# Altium schematic sheet PM12_ADT7311.SchDoc
size A4; SheetNumber: 14; SheetTotal: 33
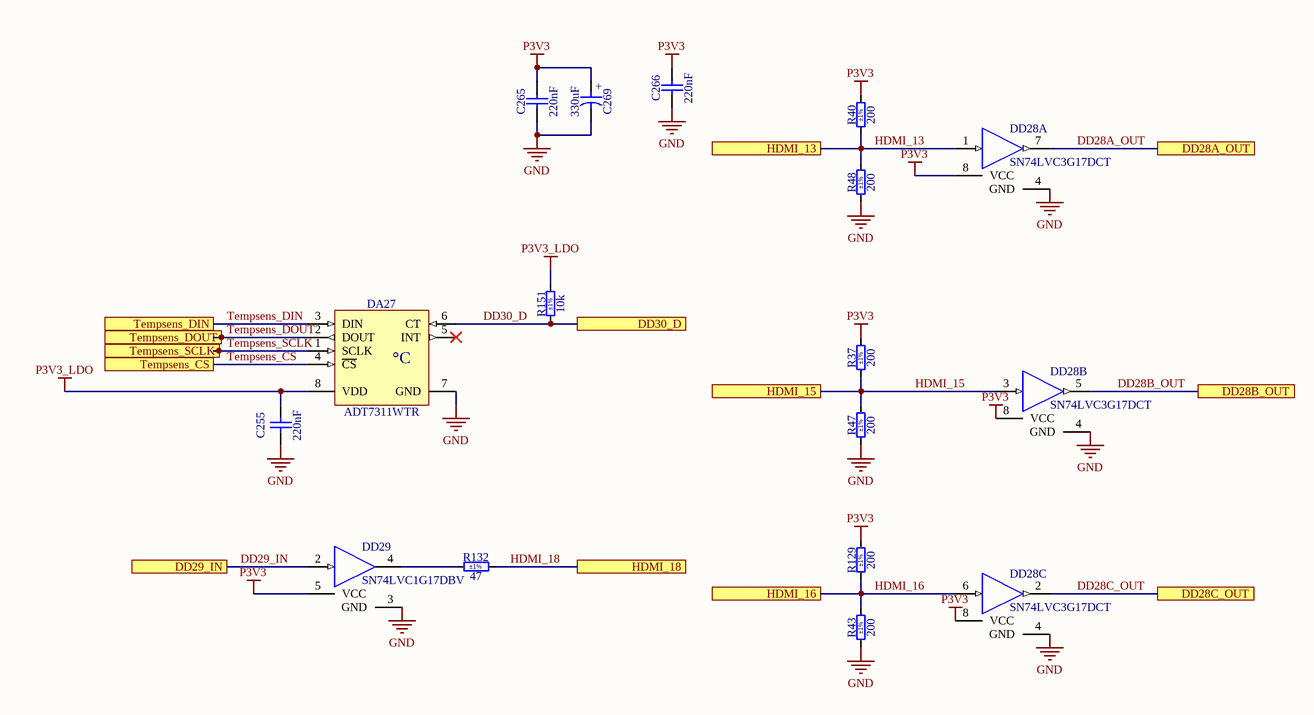
[diagram p0: PM12_ADT7311.SchDoc]

## Parts
C255  220nF  [CAPC2012X135N]
C265  220nF  [CAPC2012X135N]
C266  220nF  [CAPC2012X135N]
C269  330uF  [CAPMP7343X310N]
DA27  ADT7311WTR  [SOIC127P600X175-8N]
DD28  SN74LVC3G17DCT  [SOP65P400X130-8N]  (parts A,B,C of 3)
DD29  SN74LVC1G17DBV  [SOT95P280X145-5N]
R37  200  Tolerance: ±1%  [RESC2012X60N]
R40  200  Tolerance: ±1%  [RESC2012X60N]
R43  200  Tolerance: ±1%  [RESC2012X60N]
R47  200  Tolerance: ±1%  [RESC2012X60N]
R48  200  Tolerance: ±1%  [RESC2012X60N]
R129  200  Tolerance: ±1%  [RESC2012X60N]
R132  47  Tolerance: ±1%  [RESC2012X60N]
R151  10k  Tolerance: ±1%  [RESC2012X60N]

## Ports
DD28A_OUT, DD28B_OUT, DD28C_OUT, DD29_IN, DD30_D, HDMI_13, HDMI_15, HDMI_16, HDMI_18, Tempsens_CS, Tempsens_DIN, Tempsens_DOUT, Tempsens_SCLK

## Nets
GND: C255.1 C265.1 C266.1 C269.2 DA27.7(GND) DD28.4(GND) DD29.3(GND) R43.1 R47.1 R48.1
P3V3: C265.2 C266.2 C269.1 DD28.8(VCC) DD29.5(VCC) R37.2 R40.2 R129.2
P3V3_LDO: C255.2 DA27.8(VDD) R151.2
DD28A_OUT: DD28.7(OUT) ; port DD28A_OUT
DD28B_OUT: DD28.5(OUT) ; port DD28B_OUT
DD28C_OUT: DD28.2(OUT) ; port DD28C_OUT
DD29_IN: DD29.2(IN) ; port DD29_IN
DD30_D: DA27.6(CT) R151.1 ; port DD30_D
HDMI_13: DD28.1(IN) R40.1 R48.2 ; port HDMI_13
HDMI_15: DD28.3(IN) R37.1 R47.2 ; port HDMI_15
HDMI_16: DD28.6(IN) R43.2 R129.1 ; port HDMI_16
HDMI_18: R132.2 ; port HDMI_18
Tempsens_CS: DA27.4(~{CS}) ; port Tempsens_CS
Tempsens_DIN: DA27.3(DIN) ; port Tempsens_DIN
Tempsens_DOUT: DA27.2(DOUT) ; port Tempsens_DOUT
Tempsens_SCLK: DA27.1(SCLK) ; port Tempsens_SCLK
NetDD29_4: DD29.4(OUT) R132.1

Not connected (* = marked no-connect by the designer): DA27 5(INT)*

## Notes on the sheet
- (in symbol ADT7311WTR) °C
- (in symbol CTE7343-31_330UF_6.3V_20%_LESR0015_KEMET_T520) +

## Library data of the parts
C255 C265 C266 = CC0805_220NF_50V_10%_X7R: Non-polarised capacitor; Part Description: SMD Multilayer Chip Ceramic Capacitor; Manufacturer: GENERIC; Manufacturer1 Part Number: GRM21BR71H224KA01L; Voltage: 50V; TC: X7R; Tolerance: ±10%; Part Number: CC0805_220NF_50V_10%_X7R; Component Kind: Standard; Component Type: Standard; Pin Count: 2; Value: 220nF; Status: Preferred; Manufacturer Part Number: CC0805_220NF_50V_10%_X7R; Case: 0805; Mounted: Yes; Socket: No; SMD: Yes; Sense: No; Manufacturer1 Example: MURATA; Manufacturer1 ComponentHeight: 1.35mm; HelpURL: \\cern.ch\dfs\Applications\Altium\Datasheets\CC0805_X7R_MURATA.pdf; Author: CERN DEM JLC; CreateDate: 03.12.2007; LatestRevisionDate: 03.12.2007
C269 = CTE7343-31_330UF_6.3V_20%_LESR0015_KEMET_T520: Polarised capacitor; Part Description: Low ESR 0R015 Tantalum Chip Capacitor; Manufacturer: KEMET; Manufacturer Part Number: T520D337M006ATE015; Voltage: 6.3V; Tolerance: ±20%; Part Number: CTE7343-31_330UF_6.3V_20%_LESR0015_KEMET_T520; Component Kind: Standard; Component Type: Standard; Pin Count: 2; Value: 330uF; Status: None; Case: D; Mounted: Yes; Socket: No; SMD: Yes; Sense: No; ComponentHeight: 3.1mm; HelpURL: \\cern.ch\dfs\Applications\Altium\Datasheets\CTE-LESR_KEMET_T520.pdf; Author: CERN DEM JLC; CreateDate: 11.01.2012; LatestRevisionDate: 11.01.2012
DA27 = ADT7311WTR: ±0.5°C Accurate, 16-Bit Digital SPI Temperature Sensor; Manufacturer: ANALOG DEVICES; PressFit: No; Bonding: No; Part Number: ADT7311WTR; Component Kind: Standard; Component Type: Standard; Device: ADT7311WTR; PackageDescription: SOIC 8, Pitch 1.27mm - Body 4x5mm, IPC Medium Density; Part Description: ±0.5°C Accurate, 16-Bit Digital SPI Temperature Sensor; Manufacturer Part Number: ADT7311WTR; Pin Count: 8; Case: SOIC8; Mounted: Yes; Socket: No; SMD: Yes; Sense: No; ComponentHeight: 1.75mm; HelpURL: \\cern.ch\dfs\Applications\Altium\Datasheets\ADT7311WTR.pdf; Author: CERN DEM HF; CreateDate: 24.05.2024; LatestRevisionDate: 24.05.2024
DD28 = SN74LVC3G17DCT: Triple Schmitt-Trigger Buffer; Manufacturer: TEXAS INSTRUMENTS; PressFit: No; Bonding: No; Part Number: SN74LVC3G17DCT; Component Kind: Standard; Component Type: Standard; Device: SN74LVC3G17DCT; PackageDescription: SOP, 0.65mm Pitch; 8 Pin, 2.80mm W X 2.95mm L X 1.30mm H body, IPC Medium Density; Part Description: Triple Schmitt-Trigger Buffer; Manufacturer Part Number: SN74LVC3G17DCT; Pin Count: 8; Case: TSSOP8; Mounted: Yes; Socket: No; SMD: Yes; Sense: No; ComponentHeight: 1.3mm; Author: CERN DEM HF; HelpURL: \\cern.ch\dfs\Applications\Altium\Datasheets\SN74LVC3G17.pdf; CreateDate: 10.06.2024; LatestRevisionDate: 10.06.2024
DD29 = SN74LVC1G17DBVR: Single Schmitt-Trigger Buffer; Manufacturer: TEXAS INSTRUMENTS; PressFit: No; Bonding: No; Part Number: SN74LVC1G17DBVR; Component Kind: Standard; Component Type: Standard; Device: SN74LVC1G17DBV; PackageDescription: SOT, 0.95mm Pitch; 5 Pin, 1.60mm W X 2.90mm L X 1.45mm H body, IPC Medium Density; Part Description: Single Schmitt-Trigger Buffer; Manufacturer Part Number: SN74LVC1G17DBV; Pin Count: 5; Case: SOT23-5; Mounted: Yes; Socket: No; SMD: Yes; Sense: No; ComponentHeight: 1.45mm; Author: CERN DEM JLC; HelpURL: \\cern.ch\dfs\Applications\Altium\Datasheets\SN74LVC1G17DBVR.pdf; CreateDate: 06.11.2012; LatestRevisionDate: 06.11.2012
R37 R40 R43 R47 R48 R129 = R0805_200R_1%_0.125W_100PPM: Resistor - 1%; Part Description: General Purpose Thick Film Chip Resistor; Manufacturer: GENERIC; Manufacturer1 Part Number: NRC10F2000TRF; Power: 0.125W; TC: ±100ppm/°C; PressFit: No; Part Number: R0805_200R_1%_0.125W_100PPM; Component Kind: Standard; Component Type: Standard; Pin Count: 2; Value: 200; Status: Preferred; Manufacturer Part Number: R0805_200R_1%_0.125W_100PPM; Case: 0805; Mounted: Yes; Sense: No; Socket: No; SMD: Yes; Manufacturer1 Example: NIC COMPONENT; Manufacturer1 ComponentHeight: 0.6mm; HelpURL: \\cern.ch\dfs\Applications\Altium\Datasheets\R0805_NIC_NRC.pdf; Author: CERN DEM JLC; CreateDate: 03.12.2007; LatestRevisionDate: 13.03.2008
R132 = R0805_47R_1%_0.125W_100PPM: Resistor - 1%; Part Description: General Purpose Thick Film Chip Resistor; Manufacturer: GENERIC; Manufacturer1 Part Number: NRC10F47R0TRF; Power: 0.125W; TC: ±100ppm/°C; PressFit: No; Part Number: R0805_47R_1%_0.125W_100PPM; Component Kind: Standard; Component Type: Standard; Pin Count: 2; Value: 47; Status: Preferred; Manufacturer Part Number: R0805_47R_1%_0.125W_100PPM; Case: 0805; Mounted: Yes; Sense: No; Socket: No; SMD: Yes; Manufacturer1 Example: NIC COMPONENT; Manufacturer1 ComponentHeight: 0.6mm; HelpURL: \\cern.ch\dfs\Applications\Altium\Datasheets\R0805_NIC_NRC.pdf; Author: CERN DEM JLC; CreateDate: 03.12.2007; LatestRevisionDate: 13.03.2008
R151 = R0805_10K_1%_0.125W_100PPM: Resistor - 1%; Part Description: General Purpose Thick Film Chip Resistor; Manufacturer: GENERIC; Manufacturer1 Part Number: NRC10F1002TRF; Power: 0.125W; TC: ±100ppm/°C; PressFit: No; Part Number: R0805_10K_1%_0.125W_100PPM; Component Kind: Standard; Component Type: Standard; Pin Count: 2; Value: 10k; Status: Preferred; Manufacturer Part Number: R0805_10K_1%_0.125W_100PPM; Case: 0805; Mounted: Yes; Sense: No; Socket: No; SMD: Yes; Manufacturer1 Example: NIC COMPONENT; Manufacturer1 ComponentHeight: 0.6mm; HelpURL: \\cern.ch\dfs\Applications\Altium\Datasheets\R0805_NIC_NRC.pdf; Author: CERN DEM JLC; CreateDate: 03.12.2007; LatestRevisionDate: 13.03.2008